# EAGLE design scb-with-pour-revision-final (EAGLE 8.4.0)
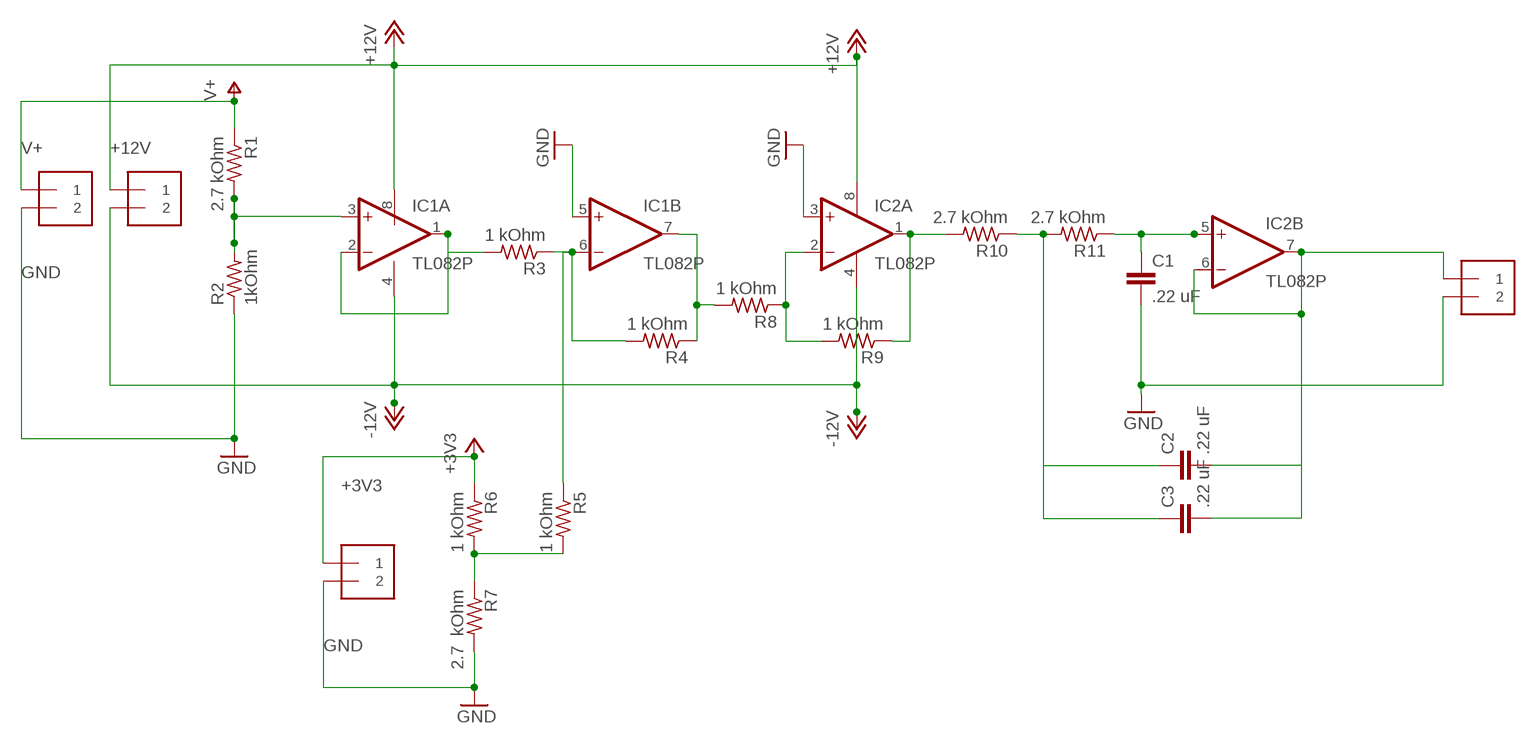
[diagram p0: schematic, sheet 1]

## Parts
C1  .22 uF  C5/5  [C5B5]
C2  .22 uF  C5/5  [C5B5]
C3  .22 uF  C5/5  [C5B5]
IC1  TL082P  [DIL08]
IC2  TL082P  [DIL08]
J1  1X2-3.5MM  [3.5MMTERM]
J2  1X2-3.5MM  [3.5MMTERM]
J3  1X2-3.5MM  [3.5MMTERM]
J4  1X2-3.5MM  [3.5MMTERM]
R1  2.7 kOhm  R-US_0207/10  [0207/10]
R2  1kOhm  R-US_0207/10  [0207/10]
R3  1 kOhm  R-US_0207/10  [0207/10]
R4  1 kOhm  R-US_0207/10  [0207/10]
R5  1 kOhm  R-US_0207/10  [0207/10]
R6  1 kOhm  R-US_0207/10  [0207/10]
R7  2.7 kOhm  R-US_0207/10  [0207/10]
R8  1 kOhm  R-US_0207/10  [0207/10]
R9  1 kOhm  R-US_0207/10  [0207/10]
R10  2.7 kOhm  R-US_0207/10  [0207/10]
R11  2.7 kOhm  R-US_0207/10  [0207/10]

## Nets
+3V3: J2.1 R6.1
+12V: IC1.8(P:V+) IC2.8(P:V+) J1.1
-12V: IC1.4(P:V-) IC2.4(P:V-) J1.2
GND: C1.2 IC1.5(B:+IN) IC2.3(A:+IN) J2.2 J3.2 J4.2 R2.1 R7.2
N$1: C2.1 C3.1 R10.1 R11.2
N$2: IC1.1(A:OUT) IC1.2(A:-IN) R3.2
N$3: IC1.7(B:OUT) R4.1 R8.2
N$4: IC2.2(A:-IN) R8.1 R9.2
N$5: R5.2 R6.2 R7.1
N$6: IC2.1(A:OUT) R9.1 R10.2
N$7: C2.2 C3.2 IC2.6(B:-IN) IC2.7(B:OUT) J4.1
N$9: C1.1 IC2.5(B:+IN) R11.1
N$12: IC1.6(B:-IN) R3.1 R4.2 R5.1
N$13: IC1.3(A:+IN) R1.2 R2.2
V+: J3.1 R1.1

## Library data of the parts
C1-C3 = capacitor-wima:C: CAPACITOR naming: grid - package width
IC1 IC2 = linear:TL082: OP AMP Data sheet <http://www.ti.com/lit/ds/symlink/tl084a . pdf>; DATA_SHEET: <a href="http://www.ti.com/lit/ds/symlink/tl084a.pdf"> Data sheet </a>
J1-J4 = adafruit:1X2: 3.5mm Terminal block http://www.ladyada.net/library/pcb/eaglelibrary.html
R1-R11 = resistor:R-US_: RESISTOR, American symbol

## Board
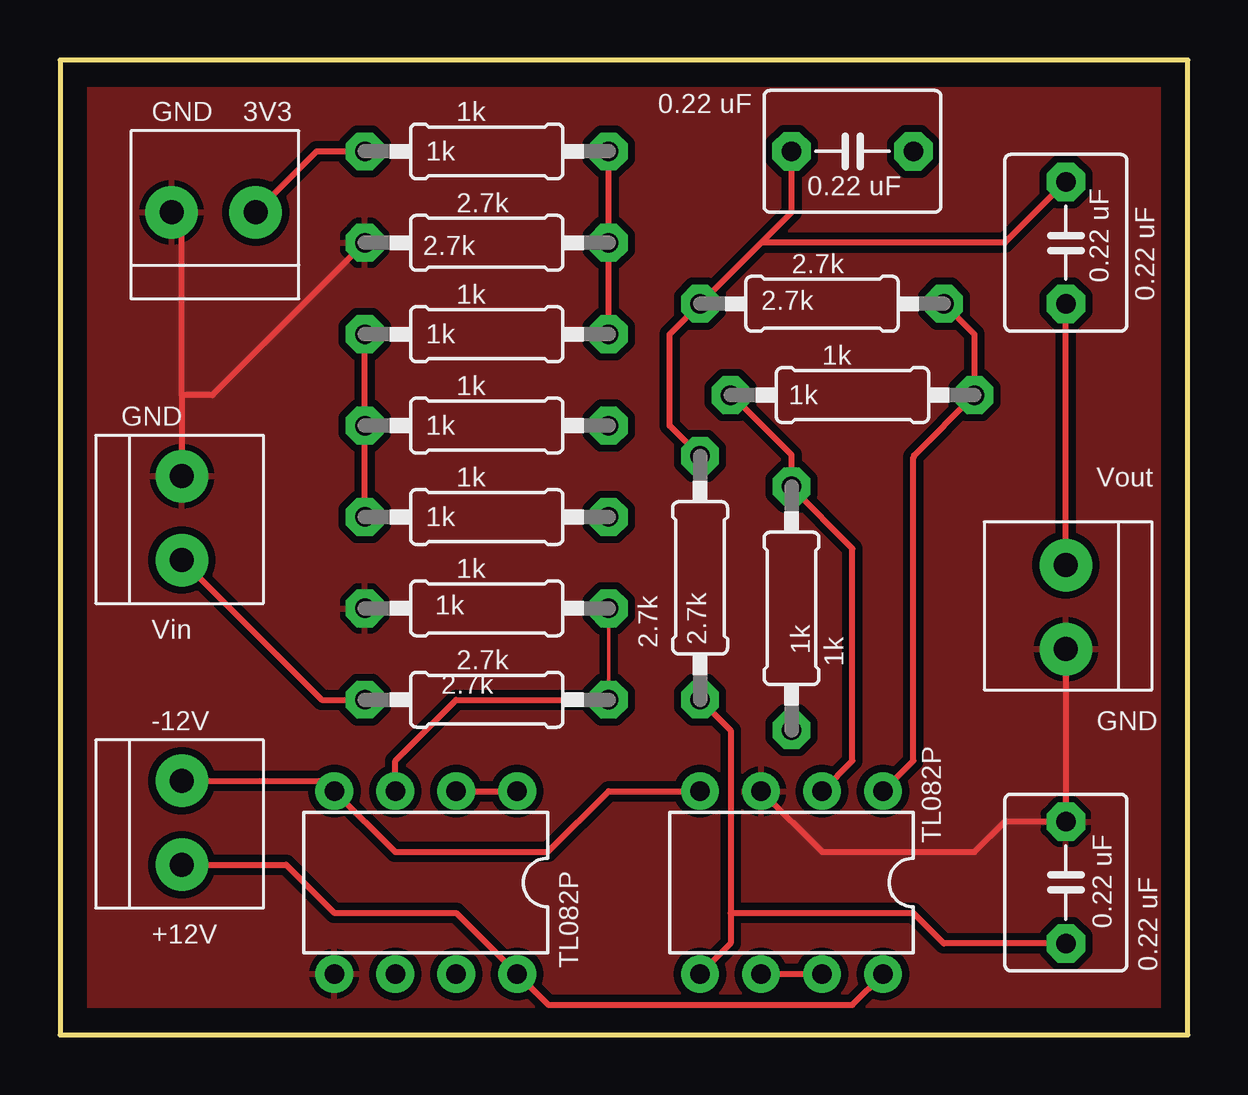
[diagram p1: board, top side]
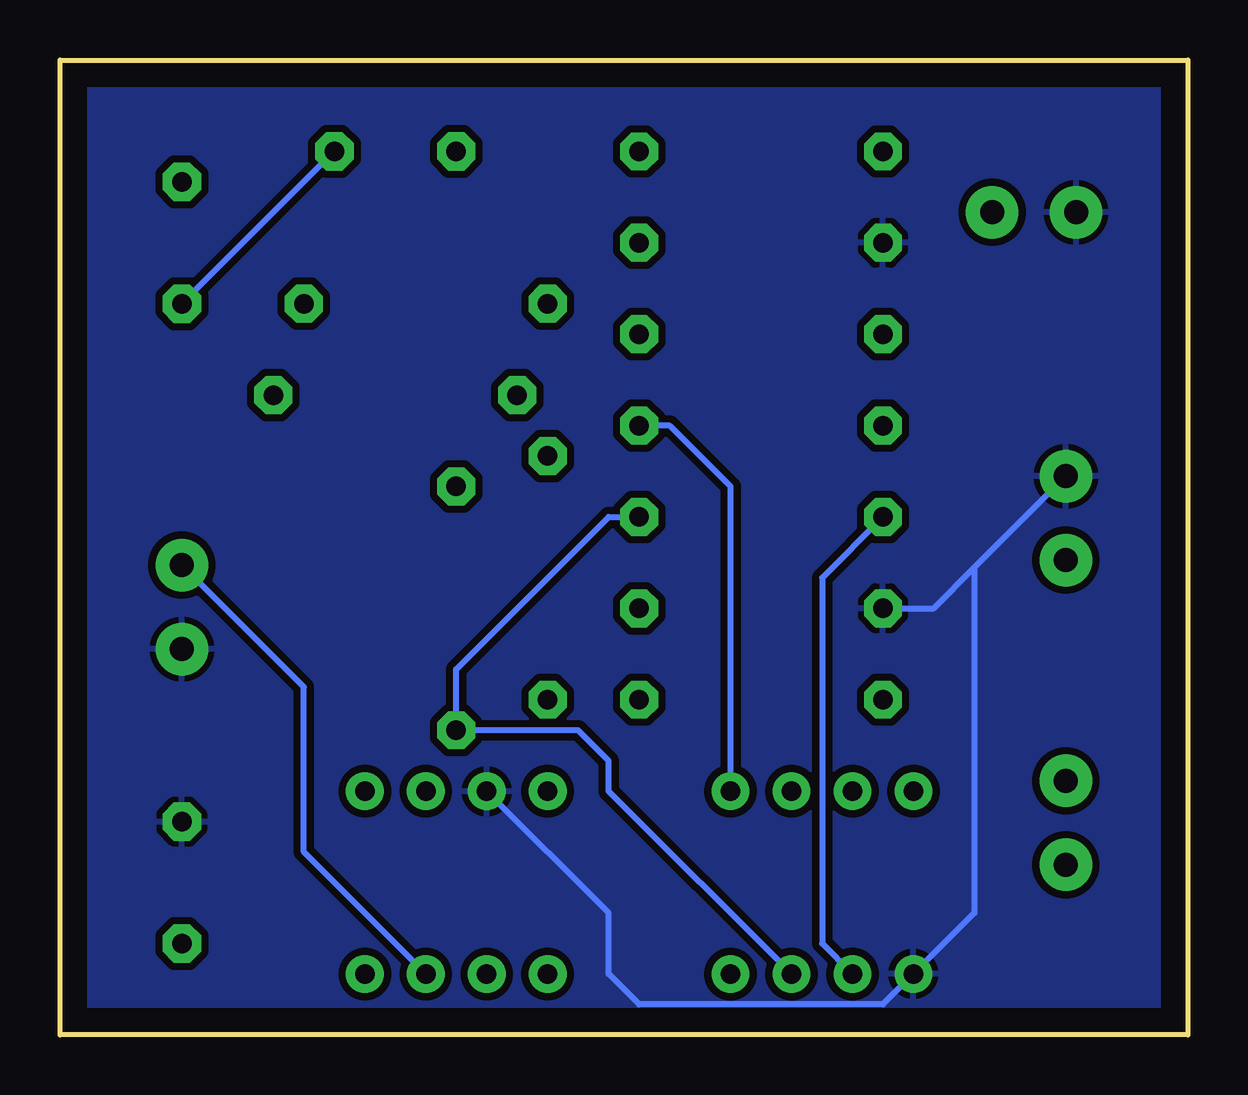
[diagram p2: board, bottom side, seen from below]

Size 46.99 x 40.64 mm. Coordinates in mm from the lower left corner, seen from the top.
Outline: 0,0 46.99,0 46.99,40.64 0,40.64 0,0
Copper layers (1*16): Top 0.035mm / dielectric 1.5mm / Bottom 0.035mm
Design rules "default *": minimum track width 6mil, minimum drill 0.35mm, track to track 12mil, track to pad 13mil, pad to pad 6mil, via to via 6mil, smd to smd 6mil, copper to edge 40mil, drill to drill 6mil, minimum pad ring 15mil, minimum via ring 8mil, stop-mask expansion 4mil, vias tented up to drill 0mil, thermal gap 10mil

### Footprints (pad centres in the part's own frame; a part is rotated, then mirrored left to right if it is on the bottom)
C5B5 = drill 0.813 pad 1.6 octagon: 1 -2.54,0; 2 2.54,0
DIL08 = drill 0.813 pad 1.27: 1 -3.81,-3.81; 2 -1.27,-3.81; 3 1.27,-3.81; 4 3.81,-3.81; 5 3.81,3.81; 6 1.27,3.81; 7 -1.27,3.81; 8 -3.81,3.81
3.5MMTERM = drill 1 pad 2.184: 1 1.8,0; 2 -1.7,0
0207/10 = drill 0.813 octagon: 1 -5.08,0; 2 5.08,0

### Placement (x,y rotation side)
C1  41.91,6.35 90 top
C2  41.91,33.02 270 top
C3  33.02,36.83 0 top
IC1  15.24,6.35 180 top
IC2  30.48,6.35 180 top
J1  5.08,8.89 270 top
J2  6.35,34.29 0 top
J3  5.08,21.59 270 top
J4  41.91,17.78 90 top
R1  17.78,13.97 0 top
R2  17.78,17.78 0 top
R3  17.78,25.4 0 top
R4  17.78,21.59 180 top
R5  17.78,29.21 0 top
R6  17.78,36.83 0 top
R7  17.78,33.02 180 top
R8  30.48,17.78 270 top
R9  33.02,26.67 180 top
R10  31.75,30.48 0 top
R11  26.67,19.05 90 top

### Tracks (layer width: path | path; a pad name or v marks a point on that pad's centre or on a via)
+3V3
  Top 0.254: J2.1 10.69,36.83 R6.1
+12V
  Top 0.254: IC2.8 34.29,2.52 33.02,1.25 20.35,1.25 IC1.8 16.51,5.08 11.43,5.08 9.42,7.09 J1.1
-12V
  Top 0.254: J1.2 11,10.59 IC1.4 13.97,7.62 20.32,7.62 22.86,10.16 IC2.4
GND
  Top 0.254: 5.08,26.67 J3.2 | 5.08,26.67 5.08,33.86 J2.2 | 5.08,26.67 6.35,26.67 R7.2 | IC2.3 31.75,7.62 38.1,7.62 39.37,8.89 C1.2 J4.2
  Bottom 0.152: 12.65,17.78 R2.1 | 5.18,23.27 J3.2
  Bottom 0.254: 8.89,19.48 J3.2 | 8.89,19.48 8.89,5.08 IC1.5 12.7,1.27 22.86,1.27 24.13,2.54 24.13,5.08 IC2.3 | R2.1 10.59,17.78 8.89,19.48
  pour Bottom (isolate 0.305): 0,40.64 0,0 46.99,0 46.99,40.64
  pour Top (isolate 0.305): 0,40.64 0,0 46.99,0 46.99,40.64
N$1
  Top 0.254: R11.2 25.4,25.4 25.4,29.21 R10.1 29.21,33.02 | 29.21,33.02 30.48,34.29 C3.1 | C2.1 39.37,33.02 29.21,33.02
N$2
  Top 0.254: IC1.2 IC1.1
  Bottom 0.254: IC1.1 19.05,22.86 21.59,25.4 R3.2
N$3
  Bottom 0.254: R4.1 24.13,21.59 30.48,15.24 R8.2 25.4,12.7 24.13,11.43 24.13,10.16 IC1.7
N$4
  Top 0.152: 31.7,10.16 IC2.2 | 30.48,22.81 R8.1
  Top 0.254: IC2.2 33.02,11.43 33.02,20.27 30.48,22.81 | R8.1 30.48,24.18 27.99,26.67 R9.2
N$5
  Top 0.254: R5.2 R7.1 R6.2
N$6
  Top 0.254: IC2.1 35.56,11.43 35.56,24.08 35.59,24.11 35.59,24.16 R9.1 38.1,29.21 R10.2
N$7
  Top 0.254: J4.1 C2.2 | IC2.6 IC2.7
  Bottom 0.254: IC2.7 36.83,7.62 36.83,14.5 J4.1 | C3.2 C2.2
N$9
  Top 0.152: 27.58,13.06 R11.1
  Top 0.254: R11.1 27.94,12.7 27.94,5.08 | IC2.5 27.94,3.81 27.94,5.08 | 27.94,5.08 35.56,5.08 36.83,3.81 C1.1
N$12
  Top 0.254: R5.1 R3.1 R4.2
  Bottom 0.254: R4.2 15.24,19.05 15.24,3.81 IC1.6
N$13
  Top 0.152: R1.2 R2.2
  Top 0.254: IC1.3 13.97,11.43 16.51,13.97 R1.2
V+
  Top 0.254: J3.1 10.9,13.97 R1.1

### Text on the board
tNames: 0.22 uF | GND | 3V3 | 1k | 1k | 0.22 uF | 2.7k | 2.7k | 2.7k | 0.22 uF | 1k | 0.22 uF | 2.7k | 1k | 1k | 1k | 1k | GND | 1k | 1k | Vout | 1k | 1k | 1k | Vin | 2.7k | 2.7k | 2.7k | 1k | 1k | 2.7k | -12V | GND | TL082P | 0.22 uF | +12V | TL082P | 0.22 uF